# EAGLE design n64_4_port (EAGLE 6.4)
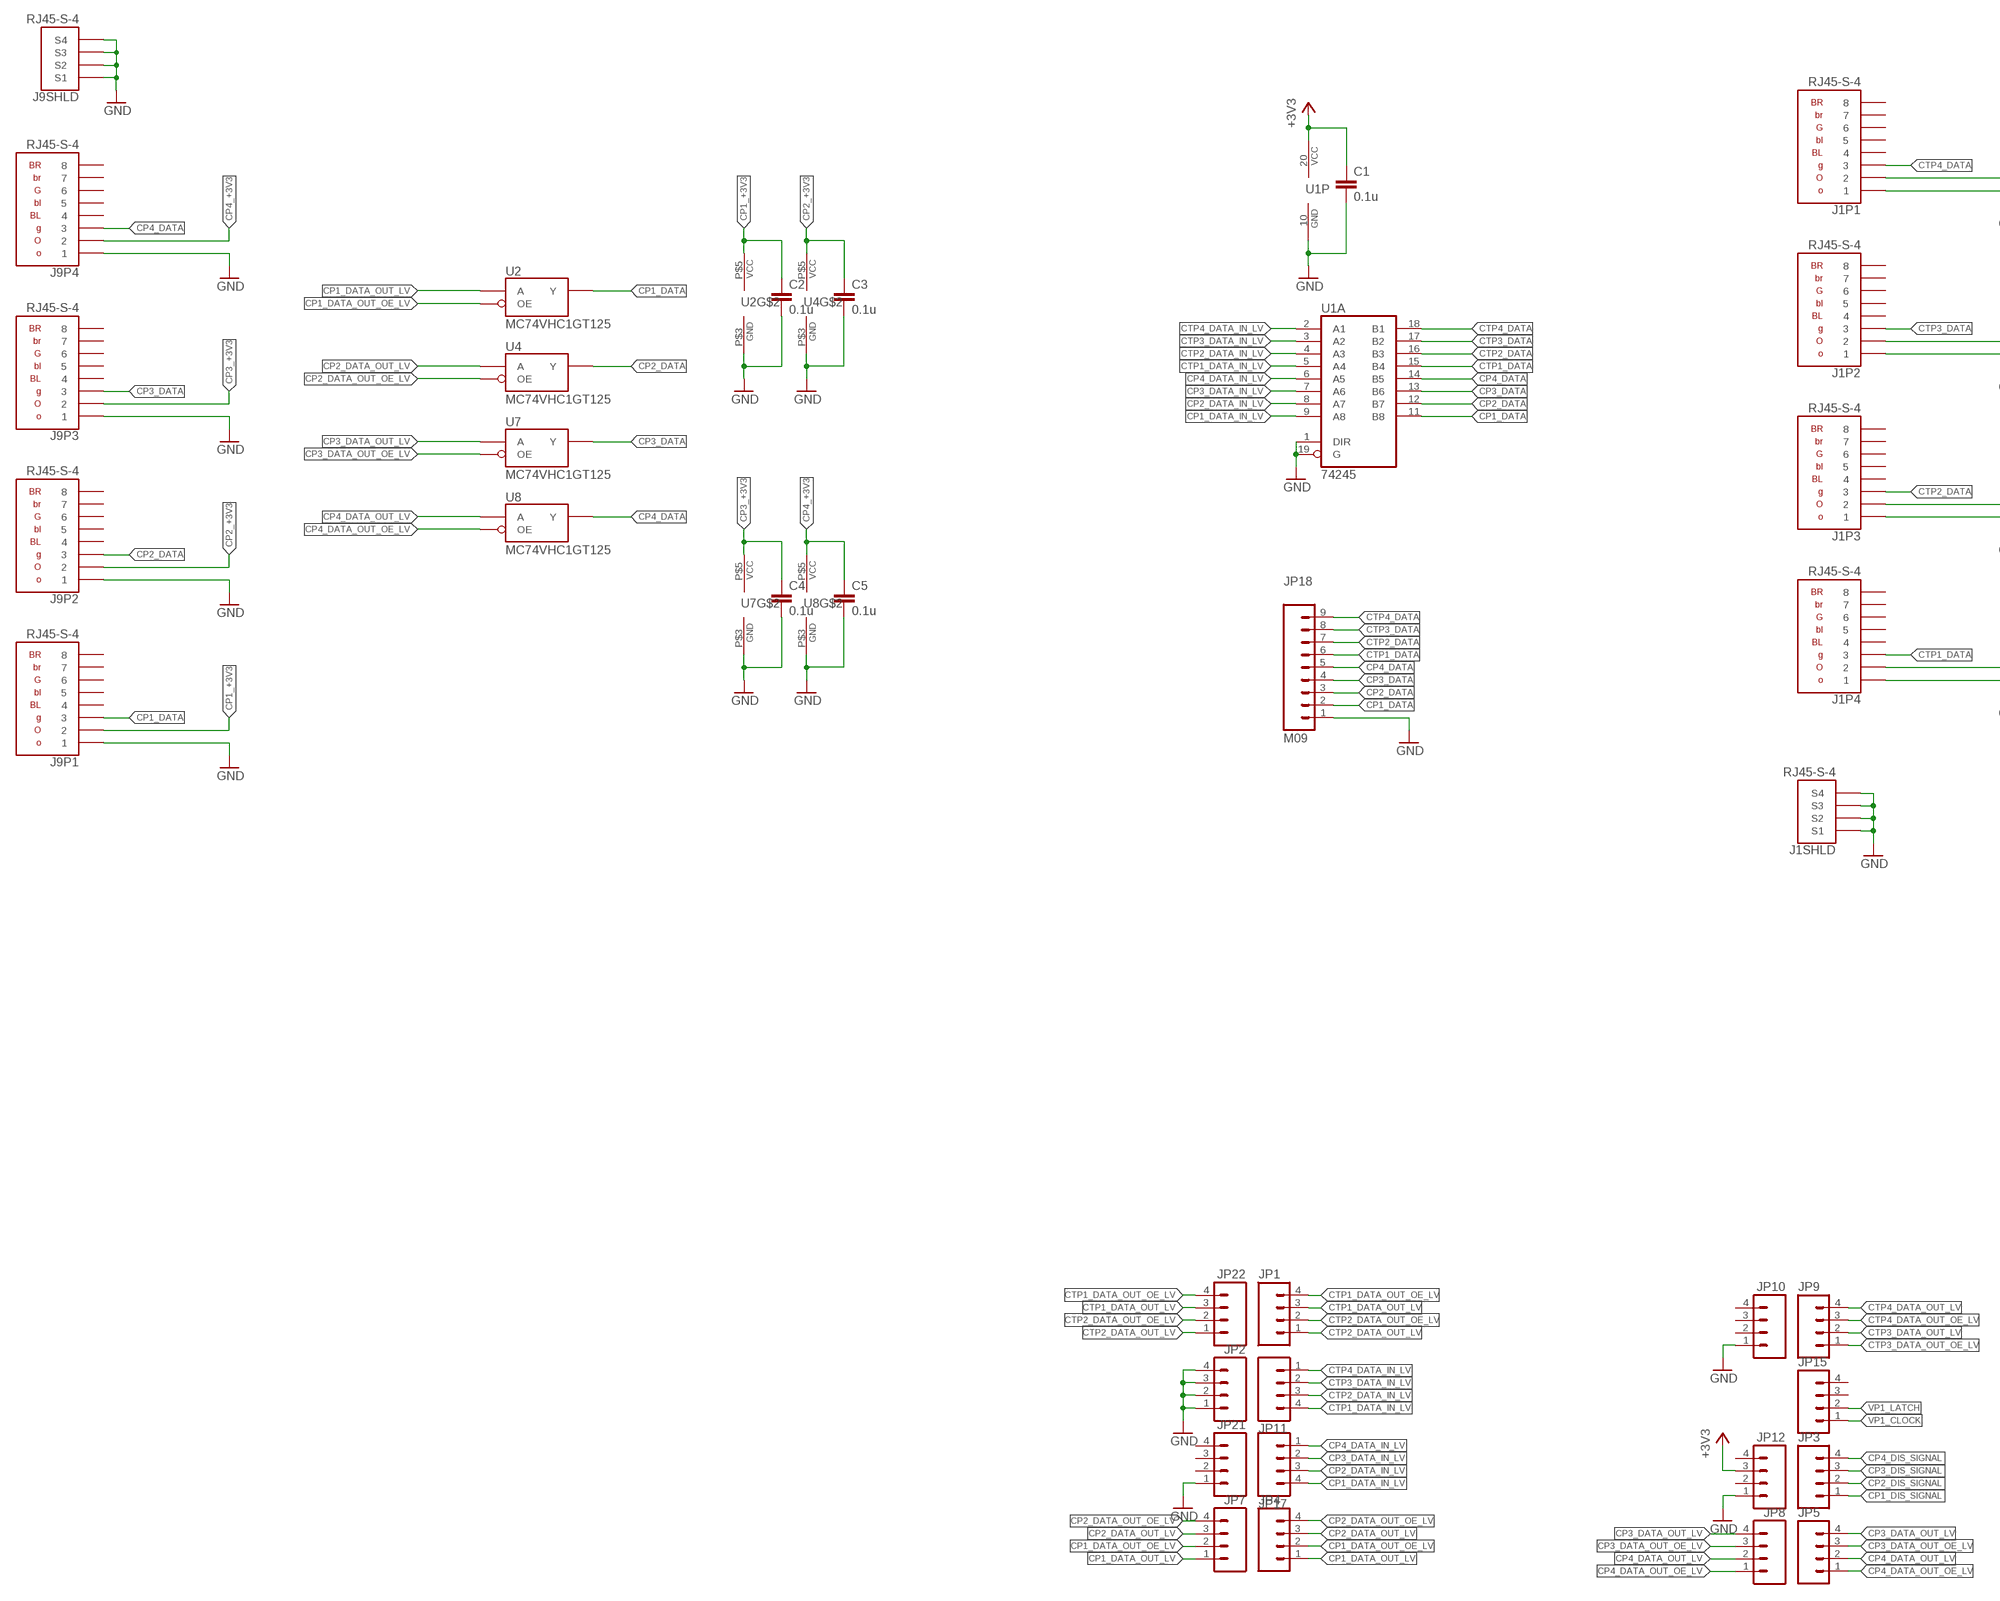
[diagram p0: schematic, sheet 1, part 1 of 2]
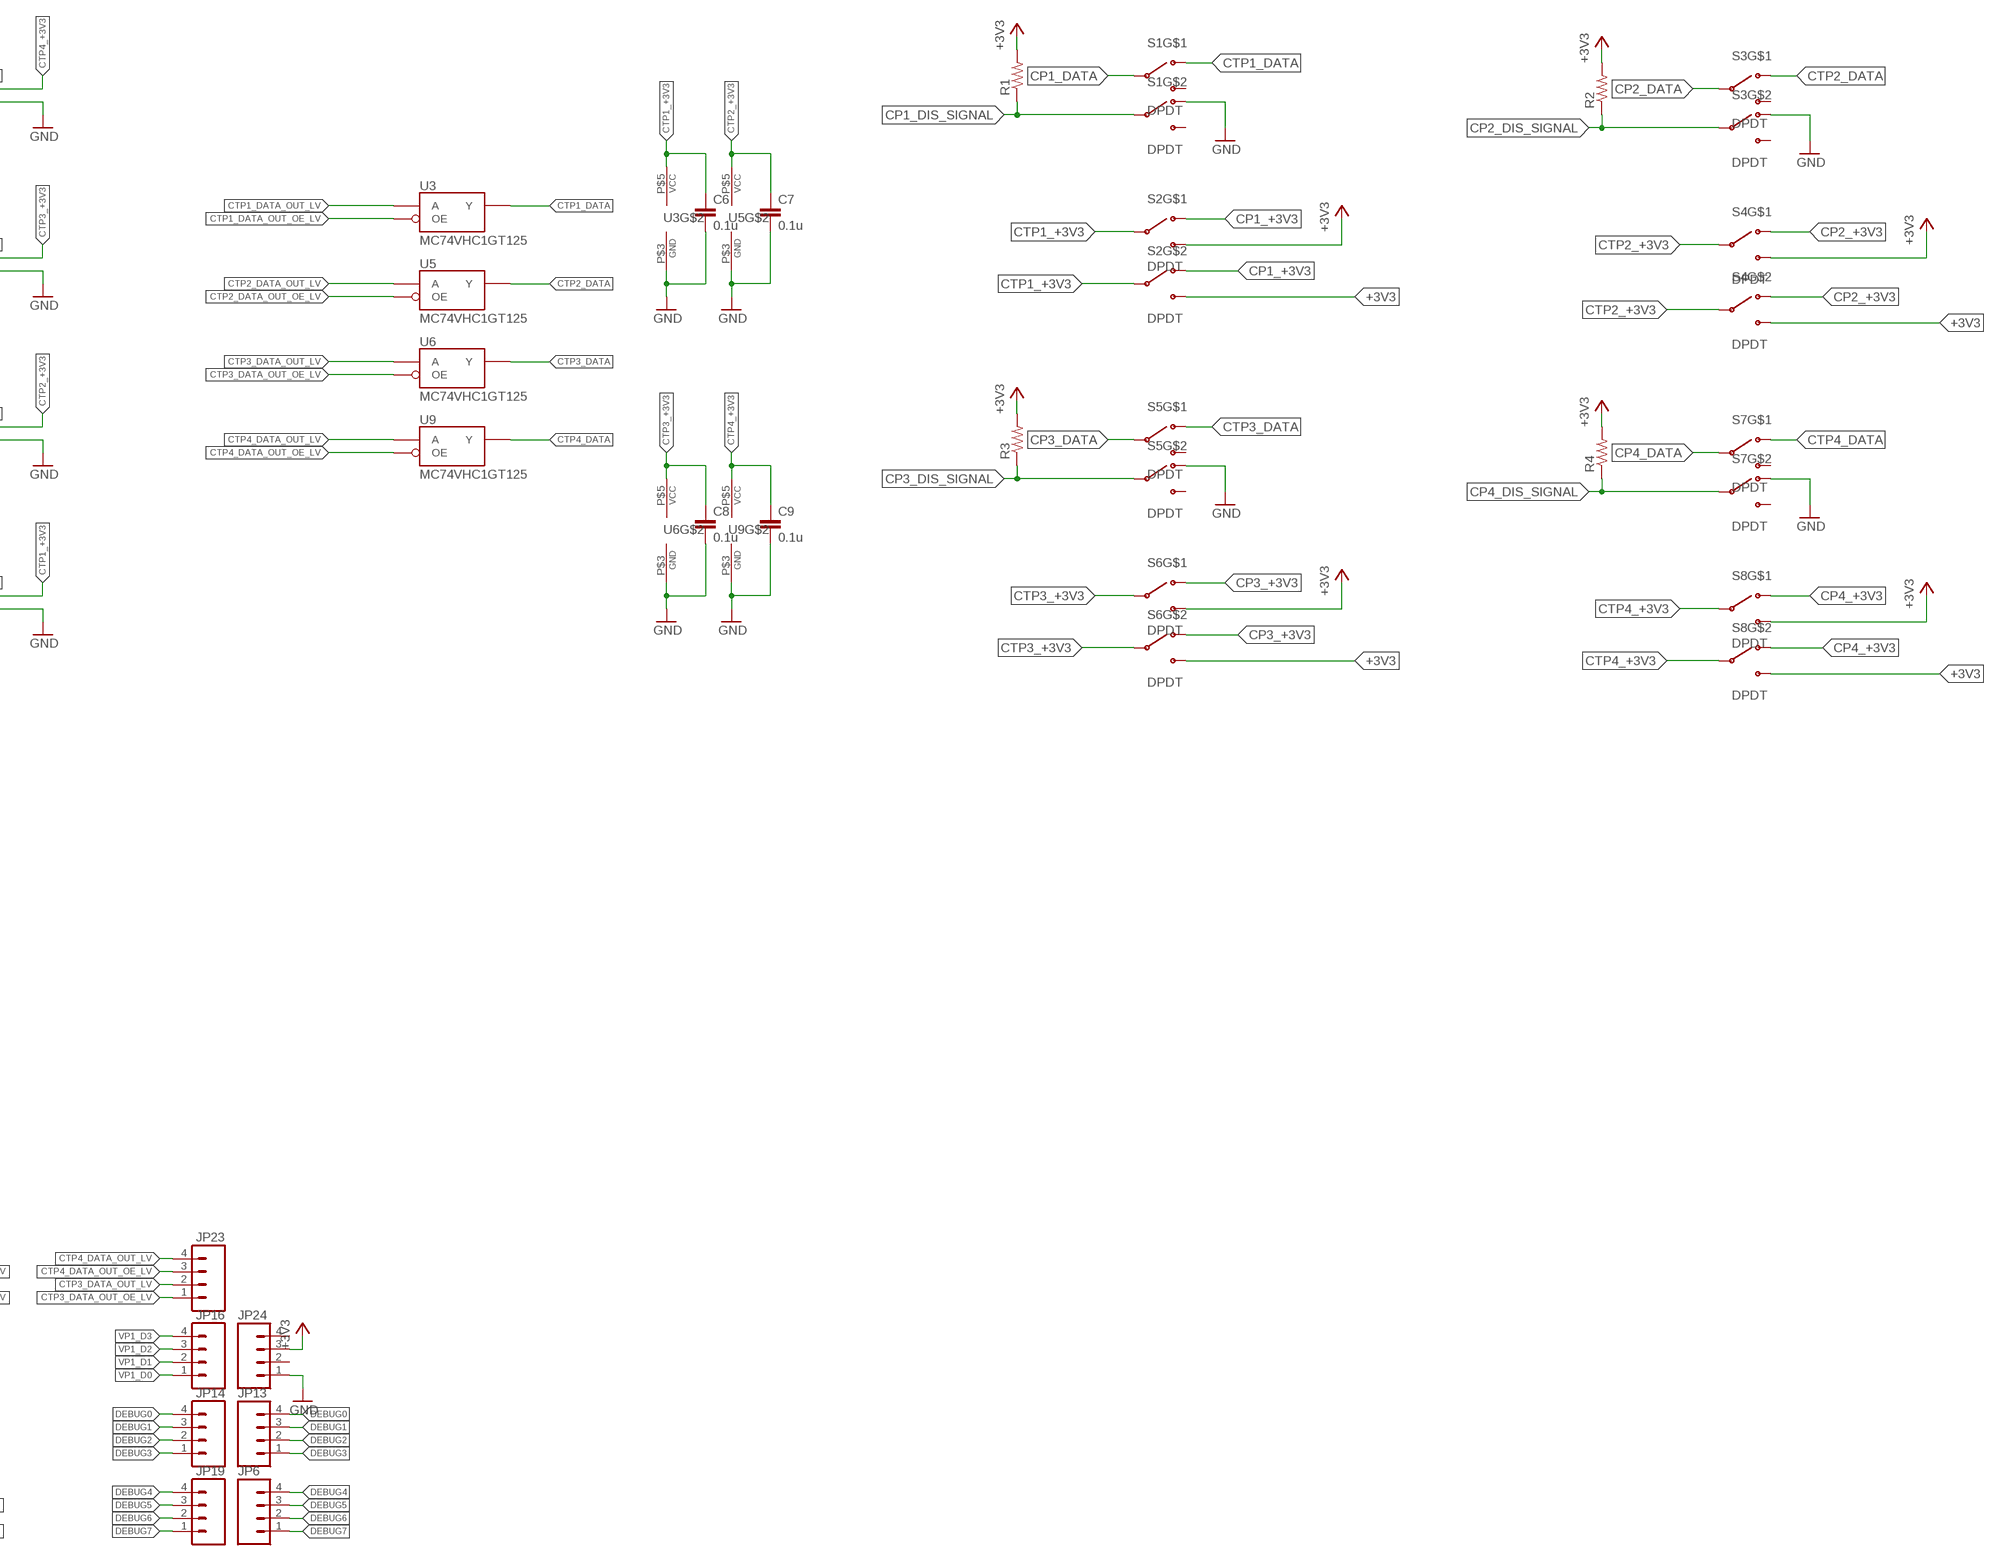
[diagram p1: schematic, sheet 1, part 2 of 2]

## Parts
C1  0.1u  C-EUC0603  [C0603]
C2  0.1u  C-EUC0603  [C0603]
C3  0.1u  C-EUC0603  [C0603]
C4  0.1u  C-EUC0603  [C0603]
C5  0.1u  C-EUC0603  [C0603]
C6  0.1u  C-EUC0603  [C0603]
C7  0.1u  C-EUC0603  [C0603]
C8  0.1u  C-EUC0603  [C0603]
C9  0.1u  C-EUC0603  [C0603]
J1  RJ45-S-4  [RJ45-S-4]
J9  RJ45-S-4  [RJ45-S-4]
JP1  M04PTH  [1X04]
JP2  M04PTH  [1X04]
JP3  M04PTH  [1X04]
JP4  M04PTH  [1X04]
JP5  M04PTH  [1X04]
JP6  M04PTH  [1X04]
JP7  M04PTH  [1X04]
JP8  M04PTH  [1X04]
JP9  M04PTH  [1X04]
JP10  M04PTH  [1X04]
JP11  M04PTH  [1X04]
JP12  M04PTH  [1X04]
JP13  M04PTH  [1X04]
JP14  M04PTH  [1X04]
JP15  M04PTH  [1X04]
JP16  M04PTH  [1X04]
JP17  M04PTH  [1X04]
JP18  M09  [1X09]
JP19  M04PTH  [1X04]
JP21  M04PTH  [1X04]
JP22  M04PTH  [1X04]
JP23  M04PTH  [1X04]
JP24  M04PTH  [1X04]
R1  R-US_0207/2V  [0207/2V]
R2  R-US_0207/2V  [0207/2V]
R3  R-US_0207/2V  [0207/2V]
R4  R-US_0207/2V  [0207/2V]
S1  DPDT  [JS202011CQN]
S2  DPDT  [JS202011CQN]
S3  DPDT  [JS202011CQN]
S4  DPDT  [JS202011CQN]
S5  DPDT  [JS202011CQN]
S6  DPDT  [JS202011CQN]
S7  DPDT  [JS202011CQN]
S8  DPDT  [JS202011CQN]
U1  74245  [DIL20]
U2  MC74VHC1GT125  [TSOP-5]
U3  MC74VHC1GT125  [TSOP-5]
U4  MC74VHC1GT125  [TSOP-5]
U5  MC74VHC1GT125  [TSOP-5]
U6  MC74VHC1GT125  [TSOP-5]
U7  MC74VHC1GT125  [TSOP-5]
U8  MC74VHC1GT125  [TSOP-5]
U9  MC74VHC1GT125  [TSOP-5]

## Nets
+3V3: C1.1 JP12.3 JP24.3 R1.2 R2.2 R3.2 R4.2 S2.3 S2.6 S4.3 S4.6 S6.3 S6.6 S8.3 S8.6 U1.20(VCC)
CP1_+3V3: C2.1 J9.1-2 S2.1 S2.4 U2.P$5(VCC)
CP1_DATA: J9.1-3 JP18.2 S1.2 U1.11(B8) U2.P$4(Y)
CP1_DATA_IN_LV: JP17.4 U1.9(A8)
CP1_DATA_OUT_LV: JP4.1 JP7.1 U2.P$2(A)
CP1_DATA_OUT_OE_LV: JP4.2 JP7.2 U2.P$1(OE)
CP1_DIS_SIGNAL: JP3.1 R1.1 S1.5
CP2_+3V3: C3.1 J9.2-2 S4.1 S4.4 U4.P$5(VCC)
CP2_DATA: J9.2-3 JP18.3 S3.2 U1.12(B7) U4.P$4(Y)
CP2_DATA_IN_LV: JP17.3 U1.8(A7)
CP2_DATA_OUT_LV: JP4.3 JP7.3 U4.P$2(A)
CP2_DATA_OUT_OE_LV: JP4.4 JP7.4 U4.P$1(OE)
CP2_DIS_SIGNAL: JP3.2 R2.1 S3.5
CP3_+3V3: C4.1 J9.3-2 S6.1 S6.4 U7.P$5(VCC)
CP3_DATA: J9.3-3 JP18.4 S5.2 U1.13(B6) U7.P$4(Y)
CP3_DATA_IN_LV: JP17.2 U1.7(A6)
CP3_DATA_OUT_LV: JP5.4 JP8.4 U7.P$2(A)
CP3_DATA_OUT_OE_LV: JP5.3 JP8.3 U7.P$1(OE)
CP3_DIS_SIGNAL: JP3.3 R3.1 S5.5
CP4_+3V3: C5.1 J9.4-2 S8.1 S8.4 U8.P$5(VCC)
CP4_DATA: J9.4-3 JP18.5 S7.2 U1.14(B5) U8.P$4(Y)
CP4_DATA_IN_LV: JP17.1 U1.6(A5)
CP4_DATA_OUT_LV: JP5.2 JP8.2 U8.P$2(A)
CP4_DATA_OUT_OE_LV: JP5.1 JP8.1 U8.P$1(OE)
CP4_DIS_SIGNAL: JP3.4 R4.1 S7.5
CTP1_+3V3: C6.1 J1.4-2 S2.2 S2.5 U3.P$5(VCC)
CTP1_DATA: J1.4-3 JP18.6 S1.1 U1.15(B4) U3.P$4(Y)
CTP1_DATA_IN_LV: JP11.4 U1.5(A4)
CTP1_DATA_OUT_LV: JP1.3 JP22.3 U3.P$2(A)
CTP1_DATA_OUT_OE_LV: JP1.4 JP22.4 U3.P$1(OE)
CTP2_+3V3: C7.1 J1.3-2 S4.2 S4.5 U5.P$5(VCC)
CTP2_DATA: J1.3-3 JP18.7 S3.1 U1.16(B3) U5.P$4(Y)
CTP2_DATA_IN_LV: JP11.3 U1.4(A3)
CTP2_DATA_OUT_LV: JP1.1 JP22.1 U5.P$2(A)
CTP2_DATA_OUT_OE_LV: JP1.2 JP22.2 U5.P$1(OE)
CTP3_+3V3: C8.1 J1.2-2 S6.2 S6.5 U6.P$5(VCC)
CTP3_DATA: J1.2-3 JP18.8 S5.1 U1.17(B2) U6.P$4(Y)
CTP3_DATA_IN_LV: JP11.2 U1.3(A2)
CTP3_DATA_OUT_LV: JP9.2 JP23.2 U6.P$2(A)
CTP3_DATA_OUT_OE_LV: JP9.1 JP23.1 U6.P$1(OE)
CTP4_+3V3: C9.1 J1.1-2 S8.2 S8.5 U9.P$5(VCC)
CTP4_DATA: J1.1-3 JP18.9 S7.1 U1.18(B1) U9.P$4(Y)
CTP4_DATA_IN_LV: JP11.1 U1.2(A1)
CTP4_DATA_OUT_LV: JP9.4 JP23.4 U9.P$2(A)
CTP4_DATA_OUT_OE_LV: JP9.3 JP23.3 U9.P$1(OE)
DEBUG0: JP13.4 JP14.4
DEBUG1: JP13.3 JP14.3
DEBUG2: JP13.2 JP14.2
DEBUG3: JP13.1 JP14.1
DEBUG4: JP6.4 JP19.4
DEBUG5: JP6.3 JP19.3
DEBUG6: JP6.2 JP19.2
DEBUG7: JP6.1 JP19.1
GND: C1.2 C2.2 C3.2 C4.2 C5.2 C6.2 C7.2 C8.2 C9.2 J1.1-1 J1.2-1 J1.3-1 J1.4-1 J1.S1(SHLD:S1) J1.S2(SHLD:S2) J1.S3(SHLD:S3) J1.S4(SHLD:S4) J9.1-1 J9.2-1 J9.3-1 J9.4-1 J9.S1(SHLD:S1) J9.S2(SHLD:S2) J9.S3(SHLD:S3) J9.S4(SHLD:S4) JP2.1 JP2.2 JP2.3 JP2.4 JP10.1 JP12.1 JP18.1 JP21.1 JP24.1 S1.4 S3.4 S5.4 S7.4 U1.1(DIR) U1.10(GND) U1.19(G) U2.P$3(GND) U3.P$3(GND) U4.P$3(GND) U5.P$3(GND) U6.P$3(GND) U7.P$3(GND) U8.P$3(GND) U9.P$3(GND)
VP1_CLOCK: JP15.1
VP1_D0: JP16.1
VP1_D1: JP16.2
VP1_D2: JP16.3
VP1_D3: JP16.4
VP1_LATCH: JP15.2
Unconnected: J1.1-4 J1.1-5 J1.1-6 J1.1-7 J1.1-8 J1.2-4 J1.2-5 J1.2-6 J1.2-7 J1.2-8 J1.3-4 J1.3-5 J1.3-6 J1.3-7 J1.3-8 J1.4-4 J1.4-5 J1.4-6 J1.4-7 J1.4-8 J9.1-4 J9.1-5 J9.1-6 J9.1-7 J9.1-8 J9.2-4 J9.2-5 J9.2-6 J9.2-7 J9.2-8 J9.3-4 J9.3-5 J9.3-6 J9.3-7 J9.3-8 J9.4-4 J9.4-5 J9.4-6 J9.4-7 J9.4-8 JP10.2 JP10.3 JP10.4 JP12.2 JP12.4 JP15.3 JP15.4 JP21.2 JP21.3 JP21.4 JP24.2 JP24.4 S1.3 S1.6 S3.3 S3.6 S5.3 S5.6 S7.3 S7.6

## Library data of the parts
C1-C9 = rcl:C-EU: CAPACITOR, European symbol
J1 J9 = TASLink:RJ45-S-4
JP1-JP17 JP19 JP21-JP24 = SparkFun-Connectors:M04: Header 4 Standard 4-pin 0.1" header. Use with straight break away headers (SKU : PRT-00116), right angle break away headers (PRT-00553), swiss pins (PRT-00743), machine pins (PRT-00117), and female headers (PRT-00115). Molex polarized connector foot print use with SKU : PRT-08231 with associated crimp pins and housings. 1MM SMD Version SKU: PRT-10208
JP18 = SparkFun-Connectors:M09: Header 9 Standard 9-pin 0.1" header. Use with straight break away headers (SKU : PRT-00116), right angle break away headers (PRT-00553), swiss pins (PRT-00743), machine pins (PRT-00117), and female headers (PRT-00115).
R1-R4 = rcl:R-US_: RESISTOR, American symbol
S1-S8 = TASLink:DPDT
U1 = TASLink:74245
U2-U9 = TASLink:MC74VHC1GT125

## Board
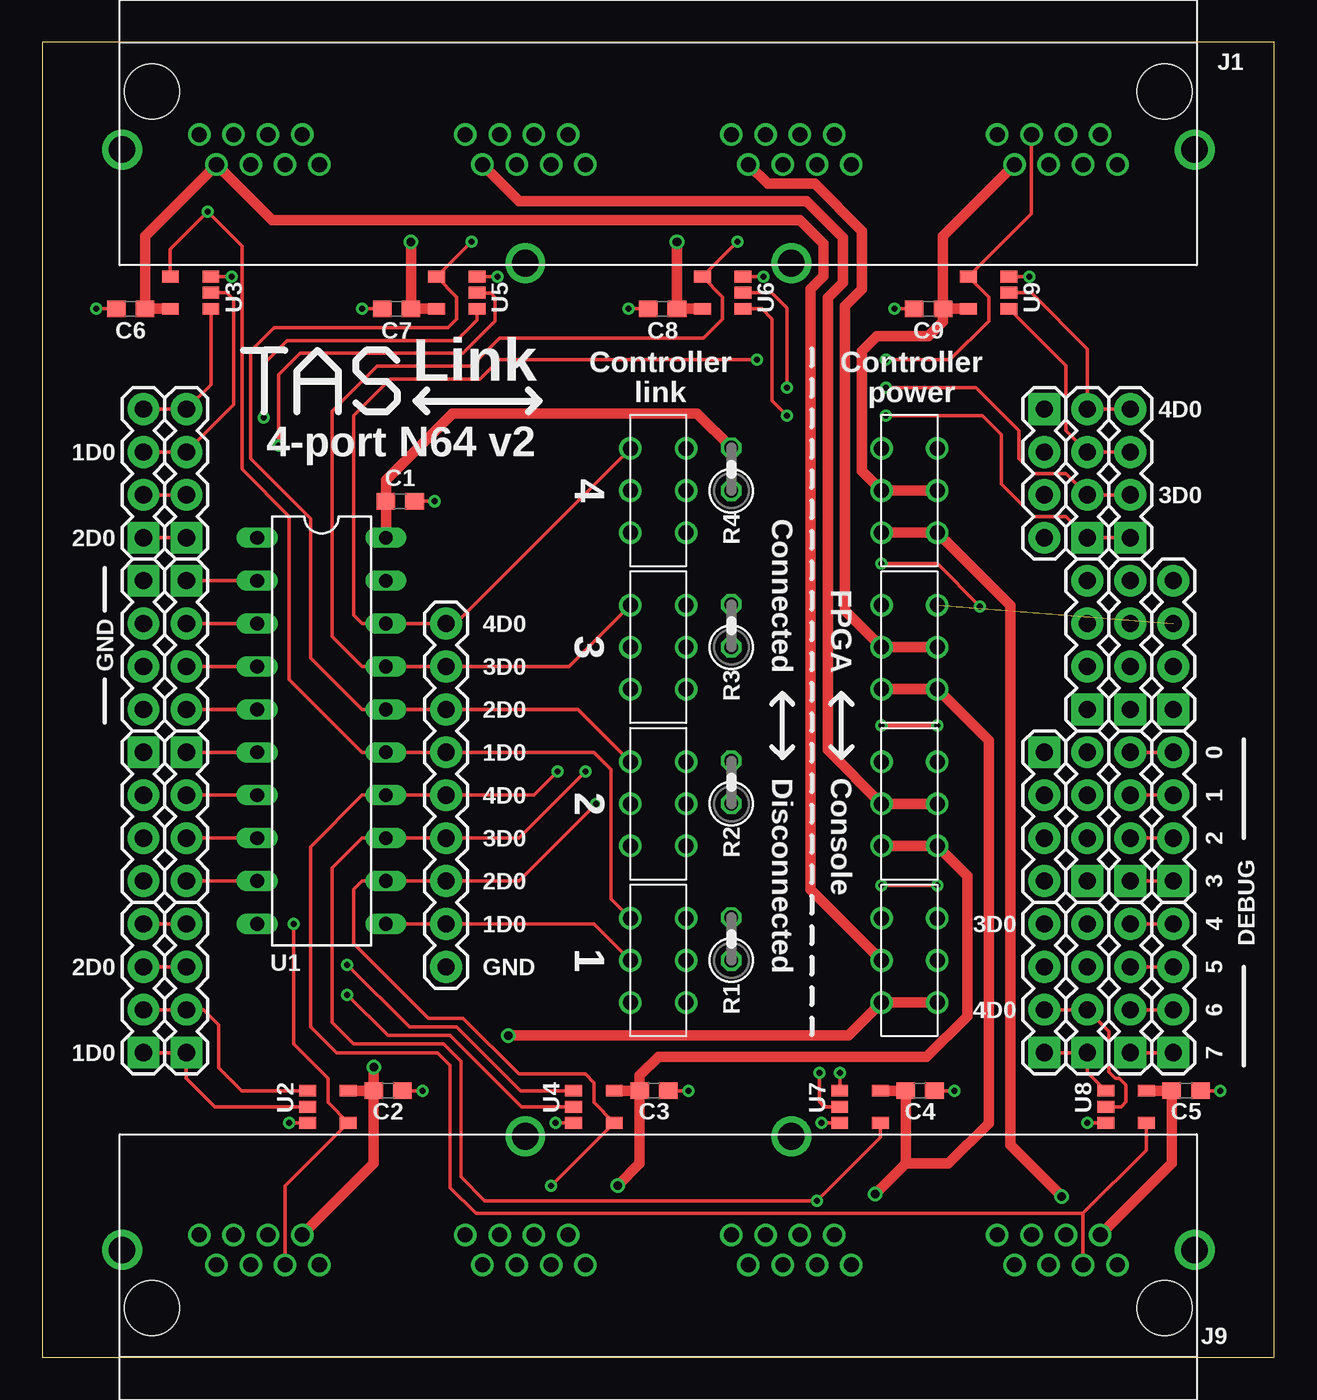
[diagram p2: board, top side]
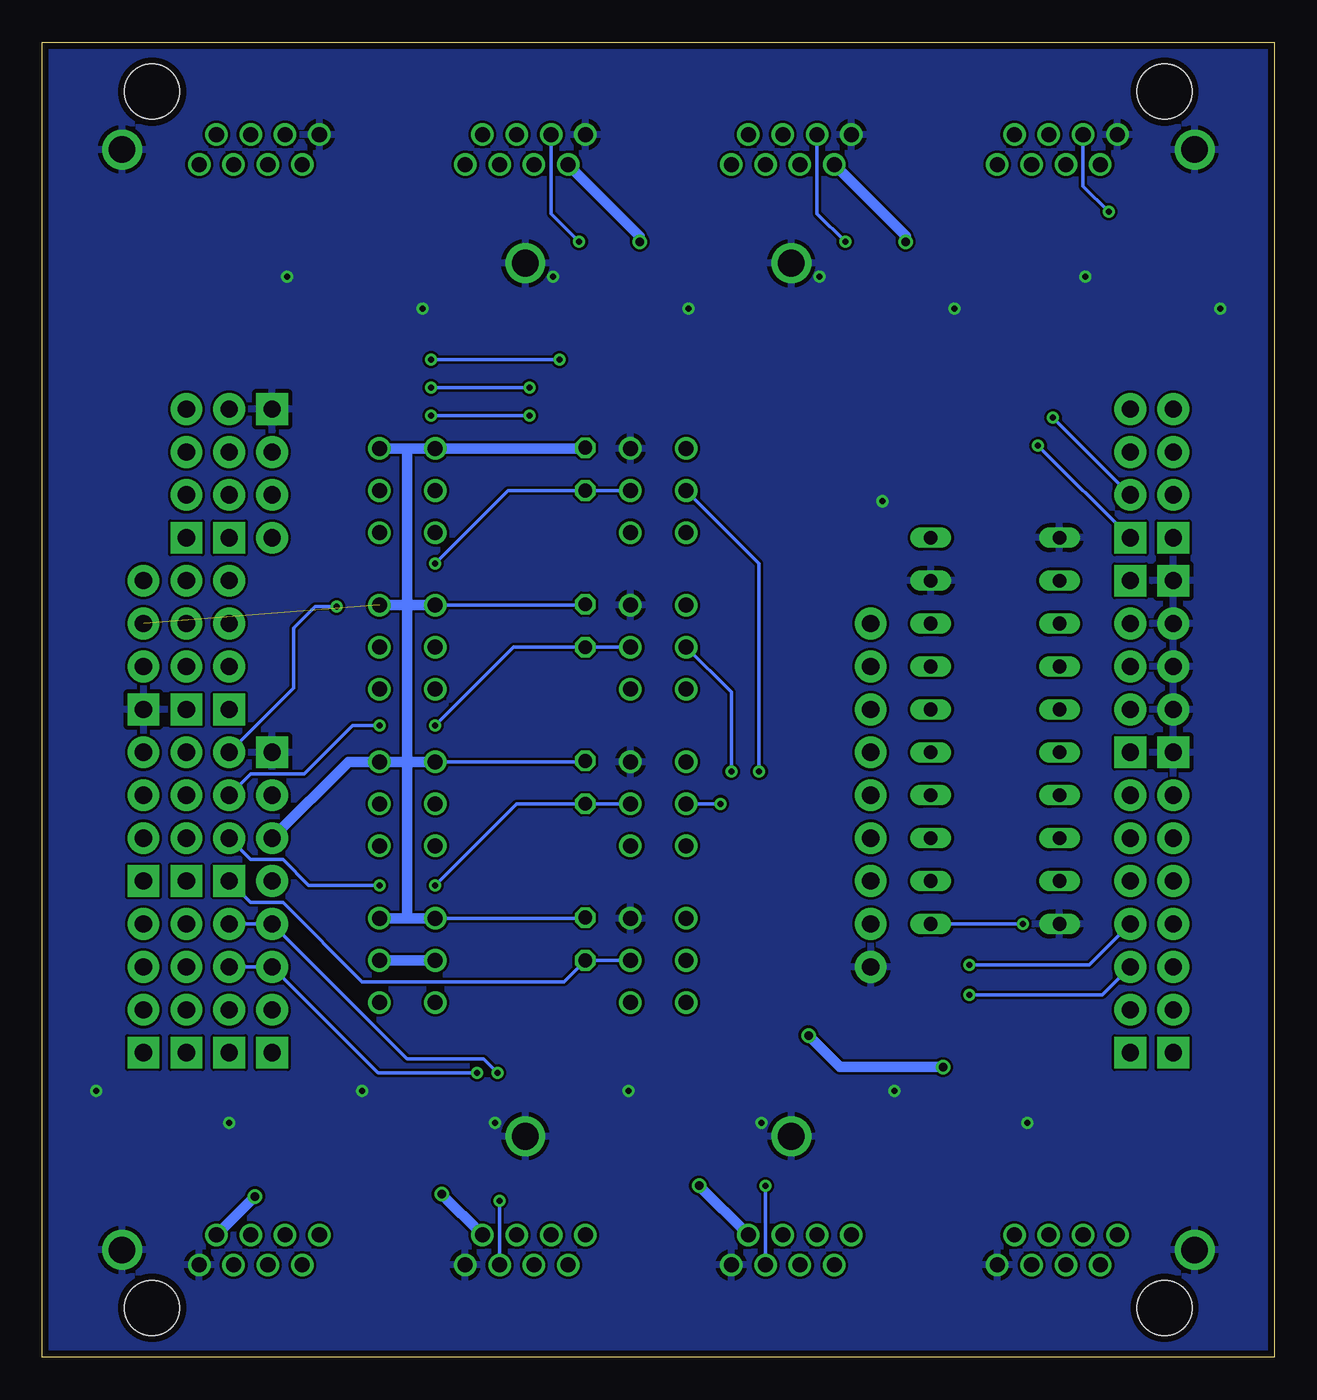
[diagram p3: board, bottom side, seen from below]

Size 72.95 x 77.85 mm. Coordinates in mm from the lower left corner, seen from the top.
Outline: 0,0 72.95,0 72.95,77.85 0,77.85 0,0
Copper layers (1*16): Top 0.0356mm / dielectric 1.5011mm / Bottom 0.0356mm
Design rules "LaenPCBOrder *": minimum track width 6mil, minimum drill 13mil, track to track 6mil, track to pad 6mil, pad to pad 6mil, via to via 6mil, smd to smd 6mil, copper to edge 15mil, drill to drill 6mil, minimum pad ring 7mil, minimum via ring 7mil, stop-mask expansion 3mil, vias tented up to drill 20mil, thermal gap 10mil

### Footprints (pad centres in the part's own frame; a part is rotated, then mirrored left to right if it is on the bottom)
C0603 = smd 1.1 x 1: 1 -0.85,0; 2 0.85,0
RJ45-S-4 = drill 0.889: 1-1 -20.066,2.54; 1-2 -21.082,4.318; 1-3 -22.098,2.54; 1-4 -23.114,4.318; 1-5 -24.13,2.54; 1-6 -25.146,4.318; 1-7 -26.162,2.54; 1-8 -27.178,4.318; 2-1 -4.318,2.54; 2-2 -5.334,4.318; 2-3 -6.35,2.54; 2-4 -7.366,4.318; 2-5 -8.382,2.54; 2-6 -9.398,4.318; 2-7 -10.414,2.54; 2-8 -11.43,4.318; 3-1 11.43,2.54; 3-2 10.414,4.318; 3-3 9.398,2.54; 3-4 8.382,4.318; 3-5 7.366,2.54; 3-6 6.35,4.318; 3-7 5.334,2.54; 3-8 4.318,4.318; 4-1 27.178,2.54; 4-2 26.162,4.318; 4-3 25.146,2.54; 4-4 24.13,4.318; 4-5 23.114,2.54; 4-6 22.098,4.318; 4-7 21.082,2.54; 4-8 20.066,4.318 | drill 1.575: S1 31.75,3.429; S2 -31.75,3.429; S3 -7.874,10.16; S4 7.874,10.16 | hole 3.251: -29.972,0; 29.972,0
1X04 = drill 1.016 pad 1.88 square: 1 0,0 | drill 1.016 pad 1.88: 2 2.54,0; 3 5.08,0; 4 7.62,0
1X09 = drill 1.016 pad 1.88: 1 0,0; 2 2.54,0; 3 5.08,0; 4 7.62,0; 5 10.16,0; 6 12.7,0; 7 15.24,0; 8 17.78,0; 9 20.32,0
0207/2V = drill 0.813 octagon: 1 -1.27,0; 2 1.27,0
JS202011CQN = drill 0.889: 1 -2.489,-1.651; 2 0,-1.651; 3 2.489,-1.651; 4 -2.489,1.651; 5 0,1.651; 6 2.489,1.651
DIL20 = drill 0.813 long: 1 -11.43,-3.81; 2 -8.89,-3.81; 3 -6.35,-3.81; 4 -3.81,-3.81; 5 -1.27,-3.81; 6 1.27,-3.81; 7 3.81,-3.81; 8 6.35,-3.81; 9 8.89,-3.81; 10 11.43,-3.81; 11 11.43,3.81; 12 8.89,3.81; 13 6.35,3.81; 14 3.81,3.81; 15 1.27,3.81; 16 -1.27,3.81; 17 -3.81,3.81; 18 -6.35,3.81; 19 -8.89,3.81; 20 -11.43,3.81
TSOP-5 = smd 0.7 x 1: P$1 0.95,1.2; P$2 0,1.2; P$3 -0.95,1.2; P$4 -0.95,-1.2; P$5 0.95,-1.2

### Placement (x,y rotation side)
C1  21.2,50.67 0 top
C2  20.47,15.78 0 top
C3  36.22,15.78 0 top
C4  51.97,15.78 0 top
C5  67.72,15.78 0 top
C6  5.23,62.07 180 top
C7  20.98,62.07 180 top
C8  36.73,62.07 180 top
C9  52.48,62.07 180 top
J1  36.47,74.93 180 top
J9  36.47,2.92 0 top
JP1  8.53,48.51 90 top
JP2  5.99,45.97 270 top
JP3  61.87,28.19 90 top
JP4  8.53,18.03 90 top
JP5  61.87,18.03 90 top
JP6  66.95,18.03 90 top
JP7  5.99,18.03 90 top
JP8  59.33,18.03 90 top
JP9  61.87,48.51 90 top
JP10  59.33,56.13 270 top
JP11  8.53,45.97 270 top
JP12  59.33,35.81 270 top
JP13  66.95,28.19 90 top
JP14  64.41,28.19 90 top
JP15  61.87,38.35 90 top
JP16  64.41,38.35 90 top
JP17  8.53,35.81 270 top
JP18  23.9,23.11 90 top
JP19  64.41,18.03 90 top
JP21  5.99,35.81 270 top
JP22  5.99,48.51 90 top
JP23  64.41,48.51 90 top
JP24  66.95,38.35 90 top
R1  40.79,24.77 90 top
R2  40.79,34.04 90 top
R3  40.79,43.31 90 top
R4  40.79,52.58 90 top
S1  36.47,23.5 270 top
S2  51.33,23.5 90 top
S3  36.47,32.77 270 top
S4  51.33,32.77 90 top
S5  36.47,42.04 270 top
S6  51.33,42.04 90 top
S7  36.47,51.31 270 top
S8  51.33,51.31 90 top
U1  16.54,37.08 270 top
U2  16.92,14.83 90 top
U3  8.79,63.02 270 top
U4  32.66,14.83 90 top
U5  24.54,63.02 270 top
U6  40.28,63.02 270 top
U7  48.41,14.83 90 top
U8  64.16,14.83 90 top
U9  56.03,63.02 270 top

### Tracks (layer width: path | path; a pad name or v marks a point on that pad's centre or on a via)
+3V3  (1 unrouted)
  Top 0.61: R4.2 38.76,55.88 24.28,55.88 20.35,51.94 C1.1 U1.20
  Bottom 0.203: S2.6 40.84,25.98 R1.2 | R2.2 40.84,35.26 S4.6 | R3.2 40.84,44.53 S6.6
  Bottom 0.61: JP12.3 54.81,35.26 S4.3 51.33,35.26 | S2.3 51.33,25.98 | 51.33,25.98 51.33,35.26 | 51.33,35.26 51.33,44.53 | 51.33,44.53 51.33,53.8 | 51.33,53.8 S8.3 | S6.3 51.33,44.53 | S6.6 51.33,44.53 | S4.6 51.33,35.26 | 51.33,53.8 S8.6 40.84,53.8 R4.2 | 51.33,25.98 S2.6
CP1_+3V3  (via drill 0.51)
  Top 0.61: S2.1 S2.4 47.73,19.05 v27.58,19.05 | U2.P$5 C2.1 | J9.1-2 19.62,11.47 C2.1 | C2.1 v19.62,17.18
  Bottom 0.61: v19.62,17.18 25.72,17.18 v27.58,19.05
CP1_DATA  (via drill 0.36)
  Top 0.203: U1.11 JP18.2 32.66,25.65 S1.2 | J9.1-3 14.38,10.14 U2.P$4 16.92,15.08 16.92,16.51 14.88,18.54 v14.88,25.65
  Bottom 0.203: 21.23,25.65 U1.11 v14.88,25.65
CP1_DATA_IN_LV
  Top 0.203: JP17.4 U1.9
CP1_DATA_OUT_LV
  Top 0.203: JP7.1 JP4.1 8.53,16.51 10.21,14.83 U2.P$2
CP1_DATA_OUT_OE_LV
  Top 0.203: JP7.2 JP4.2 9.55,20.57 10.44,19.68 10.44,17.14 11.8,15.78 U2.P$1
CP1_DIS_SIGNAL
  Bottom 0.203: S1.5 R1.1 42.06,22.23 54,22.23 58.7,26.92 60.6,26.92 JP3.1
CP2_+3V3  (via drill 0.51)
  Top 0.61: S4.4 S4.1 54.76,28.5 54.76,20.19 52.35,17.78 36.47,17.78 35.37,16.68 C3.1 | v34.06,10.16 35.37,11.47 C3.1 | C3.1 U4.P$5
  Bottom 0.61: J9.2-2 v34.06,10.16
CP2_DATA  (via drill 0.36)
  Top 0.203: v30.12,10.14 U4.P$4 32.66,15.08 32.66,16.26 32.16,16.76 28.22,16.76 24.92,20.07 22.89,20.07 18.44,24.51 18.44,27.69 18.95,28.19 U1.12 JP18.3 28.22,28.19 v32.79,32.77
  Bottom 0.203: J9.2-3 v30.12,10.14 | S3.2 v32.79,32.77
CP2_DATA_IN_LV
  Top 0.203: JP17.3 U1.8
CP2_DATA_OUT_LV  (via drill 0.36)
  Top 0.203: JP7.3 JP4.3 | v18.06,21.46 20.47,19.05 24.16,19.05 28.37,14.83 U4.P$2
  Bottom 0.203: JP4.3 10.19,21.46 v18.06,21.46
CP2_DATA_OUT_OE_LV  (via drill 0.36)
  Top 0.203: JP7.4 JP4.4 | U4.P$1 28.31,15.78 24.54,19.56 21.74,19.56 v18.06,23.24
  Bottom 0.203: JP4.4 10.95,23.24 v18.06,23.24
CP2_DIS_SIGNAL  (via drill 0.36)
  Top 0.203: v49.68,27.94 v52.98,27.94
  Bottom 0.203: S3.5 R2.1 44.86,32.77 v49.68,27.94 | JP3.2 60.6,29.46 58.7,29.46 57.18,27.94 v52.98,27.94
CP3_+3V3  (via drill 0.51)
  Top 0.61: S6.4 S6.1 56.03,36.5 56.03,13.84 53.66,11.47 51.12,11.47 | U7.P$5 C4.1 51.12,11.47 | v49.3,9.65 51.12,11.47
  Bottom 0.61: v49.3,9.65 J9.3-2
CP3_DATA  (via drill 0.36)
  Top 0.203: v32.16,34.67 28.22,30.73 JP18.4 U1.13 18.95,30.73 17.17,28.96 17.17,19.81 18.44,18.54 23.77,18.54 24.79,17.53 24.79,10.67 26.19,9.27 v45.87,9.27 49.61,13.01 U7.P$4
  Bottom 0.203: S5.2 32.16,39.37 v32.16,34.67 | J9.3-3 v45.87,9.27
CP3_DATA_IN_LV
  Top 0.203: U1.7 JP17.2
CP3_DATA_OUT_LV  (via drill 0.36)
  Top 0.203: U7.P$2 46.28,14.83 46,15.11 v46,16.83
  Bottom 0.203: JP5.4 JP8.4 51.33,17.65 46.82,17.65 v46,16.83
CP3_DATA_OUT_OE_LV  (via drill 0.36)
  Top 0.203: U7.P$1 v47.21,16.83
  Bottom 0.203: JP5.3 JP8.3 53.05,16.83 v47.21,16.83
CP3_DIS_SIGNAL  (via drill 0.36)
  Top 0.203: v49.68,37.4 v52.98,37.4
  Bottom 0.203: S5.5 R3.1 45.05,42.04 v49.68,37.4 | JP3.3 60.6,34.54 57.43,34.54 54.57,37.4 v52.98,37.4
CP4_+3V3  (via drill 0.51)
  Top 0.61: S8.4 S8.1 57.3,44.5 57.3,12.57 v60.35,9.53 | J9.4-2 66.87,11.47 C5.1 U8.P$5
  Bottom 0.61: v60.35,9.53 J9.4-2
CP4_DATA  (via drill 0.36)
  Top 0.203: v30.51,34.67 29.11,33.27 JP18.5 U1.14 18.95,33.27 15.9,30.23 15.9,19.56 17.42,18.03 23.39,18.03 24.16,17.27 24.16,10.03 25.68,8.51 61.62,8.51 | J9.4-3 61.62,8.51 | 61.62,8.51 65.36,12.25 U8.P$4
  Bottom 0.203: S7.2 30.51,46.99 v30.51,34.67
CP4_DATA_IN_LV
  Top 0.203: JP17.1 U1.6
CP4_DATA_OUT_LV
  Top 0.203: JP8.2 JP5.2 63.14,19.3 63.14,16.89 63.53,16.51 63.78,16.51 64.16,16.13 64.16,15.11 63.88,14.83 U8.P$2
CP4_DATA_OUT_OE_LV
  Top 0.203: JP8.1 JP5.1 61.87,16.87 U8.P$1
CP4_DIS_SIGNAL  (via drill 0.36)
  Top 0.203: v49.68,46.99 52.98,46.99 v55.52,44.45
  Bottom 0.203: S7.5 R4.1 45.36,51.31 v49.68,46.99 | v55.52,44.45 56.79,44.45 58.06,43.18 58.06,39.62 JP3.4
CTP1_+3V3
  Top 0.61: U3.P$5 C6.1 6.08,66.38 J1.4-2 13.61,67.31 44.86,67.31 46.25,65.91 46.25,64.01 45.49,63.25 45.49,27.69 S2.5
  Bottom 0.61: S2.2 S2.5
CTP1_DATA  (via drill 0.36)
  Top 0.203: S1.1 33.68,27.13 33.68,34.8 32.66,35.81 JP18.6 U1.15 18.95,35.81 14.63,40.13 14.63,49.78 11.84,52.58 11.84,65.79 v9.8,67.82 7.59,65.6 U3.P$4
  Bottom 0.203: v9.8,67.82 11.33,69.34 J1.4-3
CTP1_DATA_IN_LV
  Top 0.203: U1.5 JP11.4
CTP1_DATA_OUT_LV
  Top 0.203: JP22.3 JP1.3 11.33,56.39 11.33,62.61 10.92,63.02 U3.P$2
CTP1_DATA_OUT_OE_LV
  Top 0.203: JP22.4 JP1.4 9.99,57.59 U3.P$1
CTP2_+3V3  (via drill 0.51)
  Top 0.61: S4.2 S4.5 46.51,35.94 46.51,62.74 47.4,63.63 47.4,66.29 45.24,68.45 28.22,68.45 J1.3-2 | v21.83,66.04 C7.1 U5.P$5
  Bottom 0.61: v21.83,66.04 21.83,66.38 J1.3-2
CTP2_DATA  (via drill 0.36)
  Top 0.203: v25.41,66.04 U5.P$4 24.54,62.77 24.54,61.47 24.03,60.96 13.74,60.96 12.34,59.56 12.34,53.21 15.9,49.66 15.9,41.4 18.95,38.35 U1.16 JP18.7 31.72,38.35 S3.1
  Bottom 0.203: v25.41,66.04 27.08,67.71 J1.3-3
CTP2_DATA_IN_LV
  Top 0.203: JP11.3 U1.4
CTP2_DATA_OUT_LV  (via drill 0.36)
  Top 0.203: JP1.1 JP22.1 | v14,53.98 14,58.17 15.27,59.44 24.92,59.44 26.82,61.34 26.82,62.74 26.57,62.99 25.76,62.99 U5.P$2
  Bottom 0.203: JP1.1 v14,53.98
CTP2_DATA_OUT_OE_LV  (via drill 0.36)
  Top 0.203: JP1.2 JP22.2 | v13.11,55.63 13.11,58.8 14.5,60.2 24.54,60.2 25.74,61.4 U5.P$1
  Bottom 0.203: JP1.2 v13.11,55.63
CTP3_+3V3  (via drill 0.51)
  Top 0.61: S6.2 S6.5 47.52,44.2 47.52,62.23 48.54,63.25 48.54,66.67 45.75,69.47 42.95,69.47 J1.2-2 | v37.58,66.04 C8.1 U6.P$5
  Bottom 0.61: v37.58,66.04 37.58,66.38 J1.2-2
CTP3_DATA  (via drill 0.36)
  Top 0.203: v41.16,66.04 U6.P$4 40.28,62.77 40.28,61.47 39.14,60.33 27.08,60.33 25.43,58.67 19.84,58.67 17.17,56.01 17.17,42.67 18.95,40.89 U1.17 JP18.8 31.19,40.89 S5.1
  Bottom 0.203: v41.16,66.04 42.82,67.71 J1.2-3
CTP3_DATA_IN_LV
  Top 0.203: U1.3 JP11.2
CTP3_DATA_OUT_LV  (via drill 0.36)
  Top 0.203: JP23.2 JP9.2 60.6,52.32 58.7,52.32 57.81,53.21 57.81,54.86 55.27,57.4 v49.94,57.4 | v44.09,57.4 44.09,62.1 43.18,63.02 U6.P$2
  Bottom 0.203: v44.09,57.4 v49.94,57.4
CTP3_DATA_OUT_OE_LV  (via drill 0.36)
  Top 0.203: JP23.1 JP9.1 60.6,49.78 58.7,49.78 56.79,51.69 56.79,54.61 55.65,55.75 v49.94,55.75 | U6.P$1 42.61,62.07 43.21,61.47 43.21,56.64 v44.09,55.75
  Bottom 0.203: v44.09,55.75 v49.94,55.75
CTP4_+3V3
  Top 0.61: S8.2 S8.5 48.54,52.45 48.54,59.56 49.43,60.45 52.48,60.45 53.33,61.3 C9.1 | C9.1 U9.P$5 | C9.1 53.33,66.38 J1.1-2
CTP4_DATA  (via drill 0.36)
  Top 0.203: J1.1-3 58.57,67.71 U9.P$4 56.03,62.77 56.03,61.34 53.75,59.05 v49.94,59.05 | v42.32,59.05 27.08,59.05 25.93,57.91 20.6,57.91 18.44,55.75 18.44,43.94 18.95,43.43 U1.18 JP18.9 24.46,43.43 S7.1
  Bottom 0.203: v49.94,59.05 v42.32,59.05
CTP4_DATA_IN_LV
  Top 0.203: JP11.1 U1.2
CTP4_DATA_OUT_LV
  Top 0.203: JP23.4 JP9.4 61.87,59.69 58.55,63.02 U9.P$2
CTP4_DATA_OUT_OE_LV
  Top 0.203: JP23.3 JP9.3 60.6,54.86 60.6,58.7 U9.P$1
DEBUG0
  Top 0.203: JP14.4 JP13.4
DEBUG1
  Top 0.203: JP14.3 JP13.3
DEBUG2
  Top 0.203: JP14.2 JP13.2
DEBUG3
  Top 0.203: JP14.1 JP13.1
DEBUG4
  Top 0.203: JP19.4 JP6.4
DEBUG5
  Top 0.203: JP19.3 JP6.3
DEBUG6
  Top 0.203: JP19.2 JP6.2
DEBUG7
  Top 0.203: JP19.1 JP6.1
GND  (via drill 0.36)
  Top 0.203: U2.P$3 v14.63,13.88 | U4.P$3 v30.38,13.88 | U7.P$3 v46.13,13.88 | U8.P$3 v61.87,13.88 | C2.2 v22.5,15.78 | C3.2 v38.25,15.78 | C4.2 v54,15.78 | C5.2 v69.75,15.78 | C6.2 v3.2,62.07 | C7.2 v18.95,62.07 | C8.2 v34.7,62.07 | C9.2 v50.44,62.07 | U3.P$3 v11.2,63.97 | U5.P$3 v26.95,63.97 | U6.P$3 v42.7,63.97 | U9.P$3 v58.45,63.97 | C1.2 v23.22,50.67
  pour Bottom: 0,77.85 72.95,77.85 72.95,0 0,0

### Text on the board
tPlace: Link | Controller | Controller | link | power | 4D0 | 4-port N64 v2 | 1D0 | 4 | 3D0 | 2D0 | 4D0 | GND | 3 | 3D0 | Connected | FPGA | 2D0 | 1D0 | 0 | Disconnected | Console | 4D0 | 2 | 1 | 3D0 | 2 | 2D0 | 3 | DEBUG | 1D0 | 3D0 | 4 | 2D0 | GND | 1 | 5 | 4D0 | 6 | 1D0 | 7